# Altium schematic sheet LMS7002M_C.SchDoc
size 297 x 209 mm
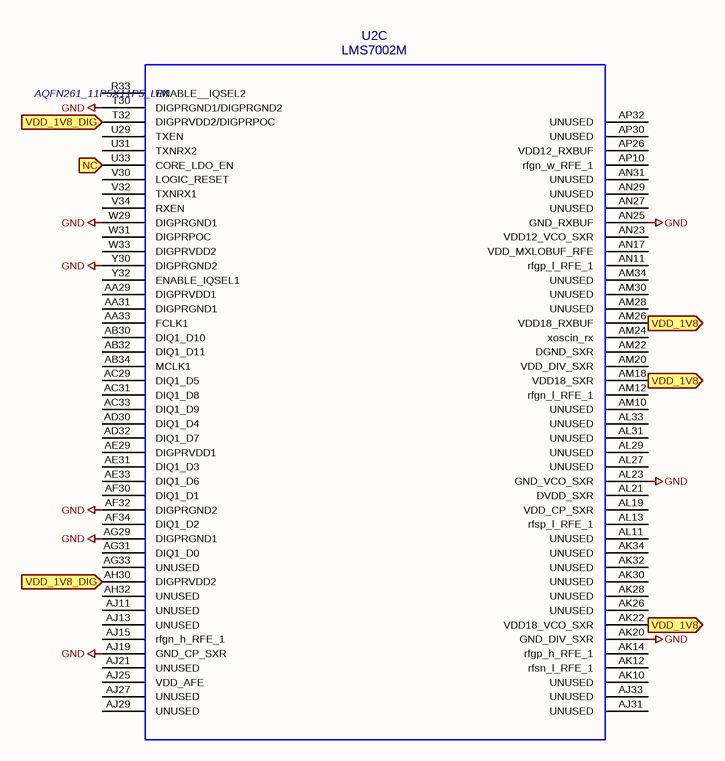
[diagram p0: LMS7002M_C.SchDoc]

## Parts
U2  LMS7002M  [AQFN261_11P5X11P5_LIM]  (part C of 3)

## Ports
NC (in), VDD_1V8 (in), VDD_1V8_DIG (in)

## Nets
GND: U2.AF32(DIGPRGND2) U2.AG29(DIGPRGND1) U2.AJ19(GND_CP_SXR) U2.AK20(GND_DIV_SXR) U2.AL23(GND_VCO_SXR) U2.AN25(GND_RXBUF) U2.T30(DIGPRGND1/DIGPRGND2) U2.W29(DIGPRGND1) U2.Y30(DIGPRGND2)
NC: U2.U33(CORE_LDO_EN) ; port NC
VDD_1V8: U2.AK22(VDD18_VCO_SXR) U2.AM18(VDD18_SXR) U2.AM26(VDD18_RXBUF) ; port VDD_1V8
VDD_1V8_DIG: U2.AH30(DIGPRVDD2) U2.T32(DIGPRVDD2/DIGPRPOC) ; port VDD_1V8_DIG

Not connected (* = marked no-connect by the designer): U2 AA29(DIGPRVDD1) AA31(DIGPRGND1) AA33(FCLK1) AB30(DIQ1_D10) AB32(DIQ1_D11) AB34(MCLK1) AC29(DIQ1_D5) AC31(DIQ1_D8) AC33(DIQ1_D9) AD30(DIQ1_D4) AD32(DIQ1_D7) AE29(DIGPRVDD1) AE31(DIQ1_D3) AE33(DIQ1_D6) AF30(DIQ1_D1) AF34(DIQ1_D2) AG31(DIQ1_D0) AG33(UNUSED) AH32(UNUSED) AJ11(UNUSED) AJ13(UNUSED) AJ15(rfgn_h_RFE_1) AJ21(UNUSED) AJ25(VDD_AFE) AJ27(UNUSED) AJ29(UNUSED) AJ31(UNUSED) AJ33(UNUSED) AK10(UNUSED) AK12(rfsn_l_RFE_1) AK14(rfgp_h_RFE_1) AK26(UNUSED) AK28(UNUSED) AK30(UNUSED) AK32(UNUSED) AK34(UNUSED) AL11(UNUSED) AL13(rfsp_l_RFE_1) AL19(VDD_CP_SXR) AL21(DVDD_SXR) AL27(UNUSED) AL29(UNUSED) AL31(UNUSED) AL33(UNUSED) AM10(UNUSED) AM12(rfgn_l_RFE_1) AM20(VDD_DIV_SXR) AM22(DGND_SXR) AM24(xoscin_rx) AM28(UNUSED) AM30(UNUSED) AM34(UNUSED) AN11(rfgp_l_RFE_1) AN17(VDD_MXLOBUF_RFE) AN23(VDD12_VCO_SXR) AN27(UNUSED) AN29(UNUSED) AN31(UNUSED) AP10(rfgn_w_RFE_1) AP26(VDD12_RXBUF) AP30(UNUSED) AP32(UNUSED) R33(ENABLE__IQSEL2) U29(TXEN) U31(TXNRX2) V30(LOGIC_RESET) V32(TXNRX1) V34(RXEN) W31(DIGPRPOC) W33(DIGPRVDD2) Y32(ENABLE_IQSEL1)

## Notes on the sheet
- 1
- 2
- 3
- 4
- 5
- 6
- A
- B
- C
- D
- Title:
- File: LMS7002M_C.kicad_sch
- Sheet: /
- KiCad E.D.A.  kicad (5.1.4)-1
- Size: A4
- Date:
- Rev:
- Id: 1/1

## Library data of the parts
U2 = LMS7002M: Value: LMS7002M